# EAGLE design thole_jst_test (EAGLE 9.6.2)
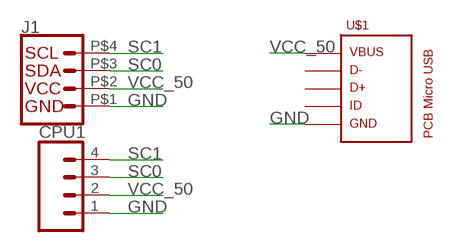
[diagram p0: schematic, sheet 1]

## Parts
CPU1  CONN_041X04_NO_SILK  [1X04_NO_SILK]
J1  Vertical Qwiic Connector  QWIIC_CONNECTORJST04_1MM_HOLE  [JST04_1MM_HOLES]
U$1  PCB_MICRO_USB_BSS_2  [USB_TYPE_B_SS_2]

## Nets
GND: CPU1.1 J1.P$1 U$1.5
SC0: CPU1.3 J1.P$3
SC1: CPU1.4 J1.P$4
VCC_50: CPU1.2 J1.P$2 U$1.1
Unconnected: U$1.2 U$1.3 U$1.4

## Library data of the parts
CPU1 = SparkFun-Connectors:CONN_04: Multi connection point. Often used as Generic Header-pin footprint for 0.1 inch spaced/style header connections On any of the 0.1 inch spaced packages, you can populate with these: Break Away Headers - Straight <https://www.sparkfun.com/products/116> (PRT-00116) Break Away Male Headers - Right Angle <https://www.sparkfun.com/products/553> (PRT-00553) Female Headers <https://www.sparkfun.com/products/115> (PRT-00115) Break Away Headers - Machine Pin <https://www.sparkfun.com/products/117> (PRT-00117) Break Away Female Headers - Swiss Machine Pin <https://www.sparkfun.com/products/743> (PRT-00743) For SCREWTERMINALS and SPRING TERMINALS visit here: Screw Terimnals on SparkFun.com <https://www.sparkfun.com/search/results?term=Screw+Terminals> (5mm/3.5mm/2.54mm spacing) This device is also useful as a general connection point to wire up your design to another part of your project. Our various solder wires solder well into these plated through hole pads. Hook-Up Wire - Assortment (Stranded, 22 AWG) <https://www.sparkfun.com/products/11375> (PRT-11375) Hook-Up Wire - Assortment (Solid Core, 22 AWG) <https://www.sparkfun.com/products/11367> (PRT-11367) View the entire wire category on our website here <https://www.sparkfun.com/categories/141> Special notes: Molex polarized connector foot print use with SKU : PRT-08231 with associated crimp pins and housings. 1MM SMD Version SKU: PRT-10208; PROD_ID: CONN-09696
J1 = 00jim:QWIIC_CONNECTOR: SparkFun I2C Standard Qwiic Connector An SMD 1mm pitch JST connector makes it easy and quick (get it? Qwiic?) to connect I2C devices to each other. The Qwiic system <http://www.sparkfun.com/qwiic> enables fast and solderless connection between popular platforms and various sensors and actuators. We carry 200mm <https://www.sparkfun.com/products/14204>, 100mm <https://www.sparkfun.com/products/14205>, 50mm <https://www.sparkfun.com/products/14206>, and breadboard friendly <https://www.sparkfun.com/products/14207> Qwiic cables. We also offer 10 pcs strips <https://www.sparkfun.com/products/14323> the SMD connectors.
U$1 = USB_pcb_connectors:PCB_MICRO_USB_B

## Board
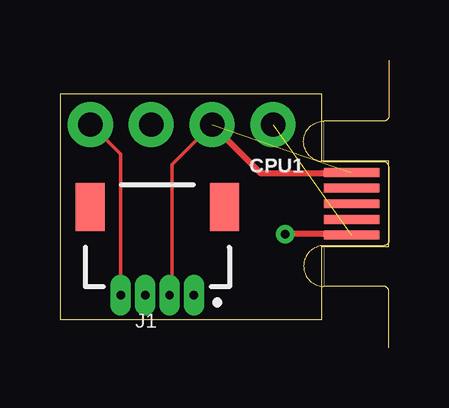
[diagram p1: board, top side]
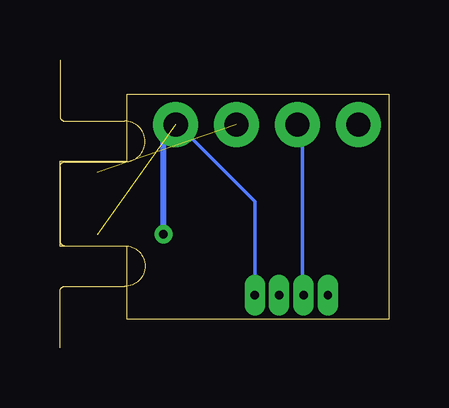
[diagram p2: board, bottom side, seen from below]

Size 13.72 x 9.4 mm. Coordinates in mm from the lower left corner, seen from the top.
Outline: 0,0 10.92,0 10.92,3.05 13.72,3.05 13.72,6.6 10.92,6.6 10.92,9.4 0,9.4 0,0
Copper layers (1*16): Top 0.035mm / dielectric 1.5mm / Bottom 0.035mm
Design rules "default": minimum track width 6mil, minimum drill 0.35mm, track to track 6mil, track to pad 6mil, pad to pad 6mil, via to via 6mil, smd to smd 6mil, copper to edge 40mil, drill to drill 6mil, minimum pad ring 10mil, minimum via ring 8mil, stop-mask expansion 4mil, vias tented up to drill 0mil, thermal gap 10mil

### Footprints (pad centres in the part's own frame; a part is rotated, then mirrored left to right if it is on the bottom)
1X04_NO_SILK = drill 1.016 pad 1.88: 1 0,0; 2 2.54,0; 3 5.08,0; 4 7.62,0
JST04_1MM_HOLES = smd 1.2 x 2: NC1 2.8,0.135; NC2 -2.8,0.135 | drill 0.35 pad 0.61 long: P$1 -1.524,3.81; P$2 -0.508,3.81; P$3 0.508,3.81; P$4 1.524,3.81
USB_TYPE_B_SS_2 = smd 0.37 x 2.3: 1 -1.3,-1.55; 2 -0.65,-1.55; 3 0,-1.55; 4 0.65,-1.55; 5 1.3,-1.55

### Placement (x,y rotation side)
CPU1  8.89,8.13 180 top
J1  4.06,4.83 180 top
U$1  13.72,4.83 270 top

### Tracks (layer width: path | path; a pad name or v marks a point on that pad's centre or on a via)
GND  (1 unrouted)
  Bottom 0.152: J1.P$1 5.59,4.93 8.79,8.13 CPU1.1
N$1
  Top 0.254: 11.68,3.56 9.65,3.56
N$2
  Top 0.254: 11.68,6.1 9.65,6.1 8.38,6.1 6.35,8.13
N$3  (via drill 0.35)
  Bottom 0.254: v9.4,3.56 9.4,7.62 8.89,8.13
SC0
  Bottom 0.152: J1.P$3 3.61,1.12 3.61,7.98 3.76,8.13 CPU1.3
SC1
  Top 0.152: J1.P$4 2.54,6.91 1.32,8.13 CPU1.4
VCC_50  (1 unrouted)
  Top 0.152: CPU1.2 4.67,6.45 4.67,1.12 J1.P$2